# Altium project UAVCAN LIDAR.PrjPcb
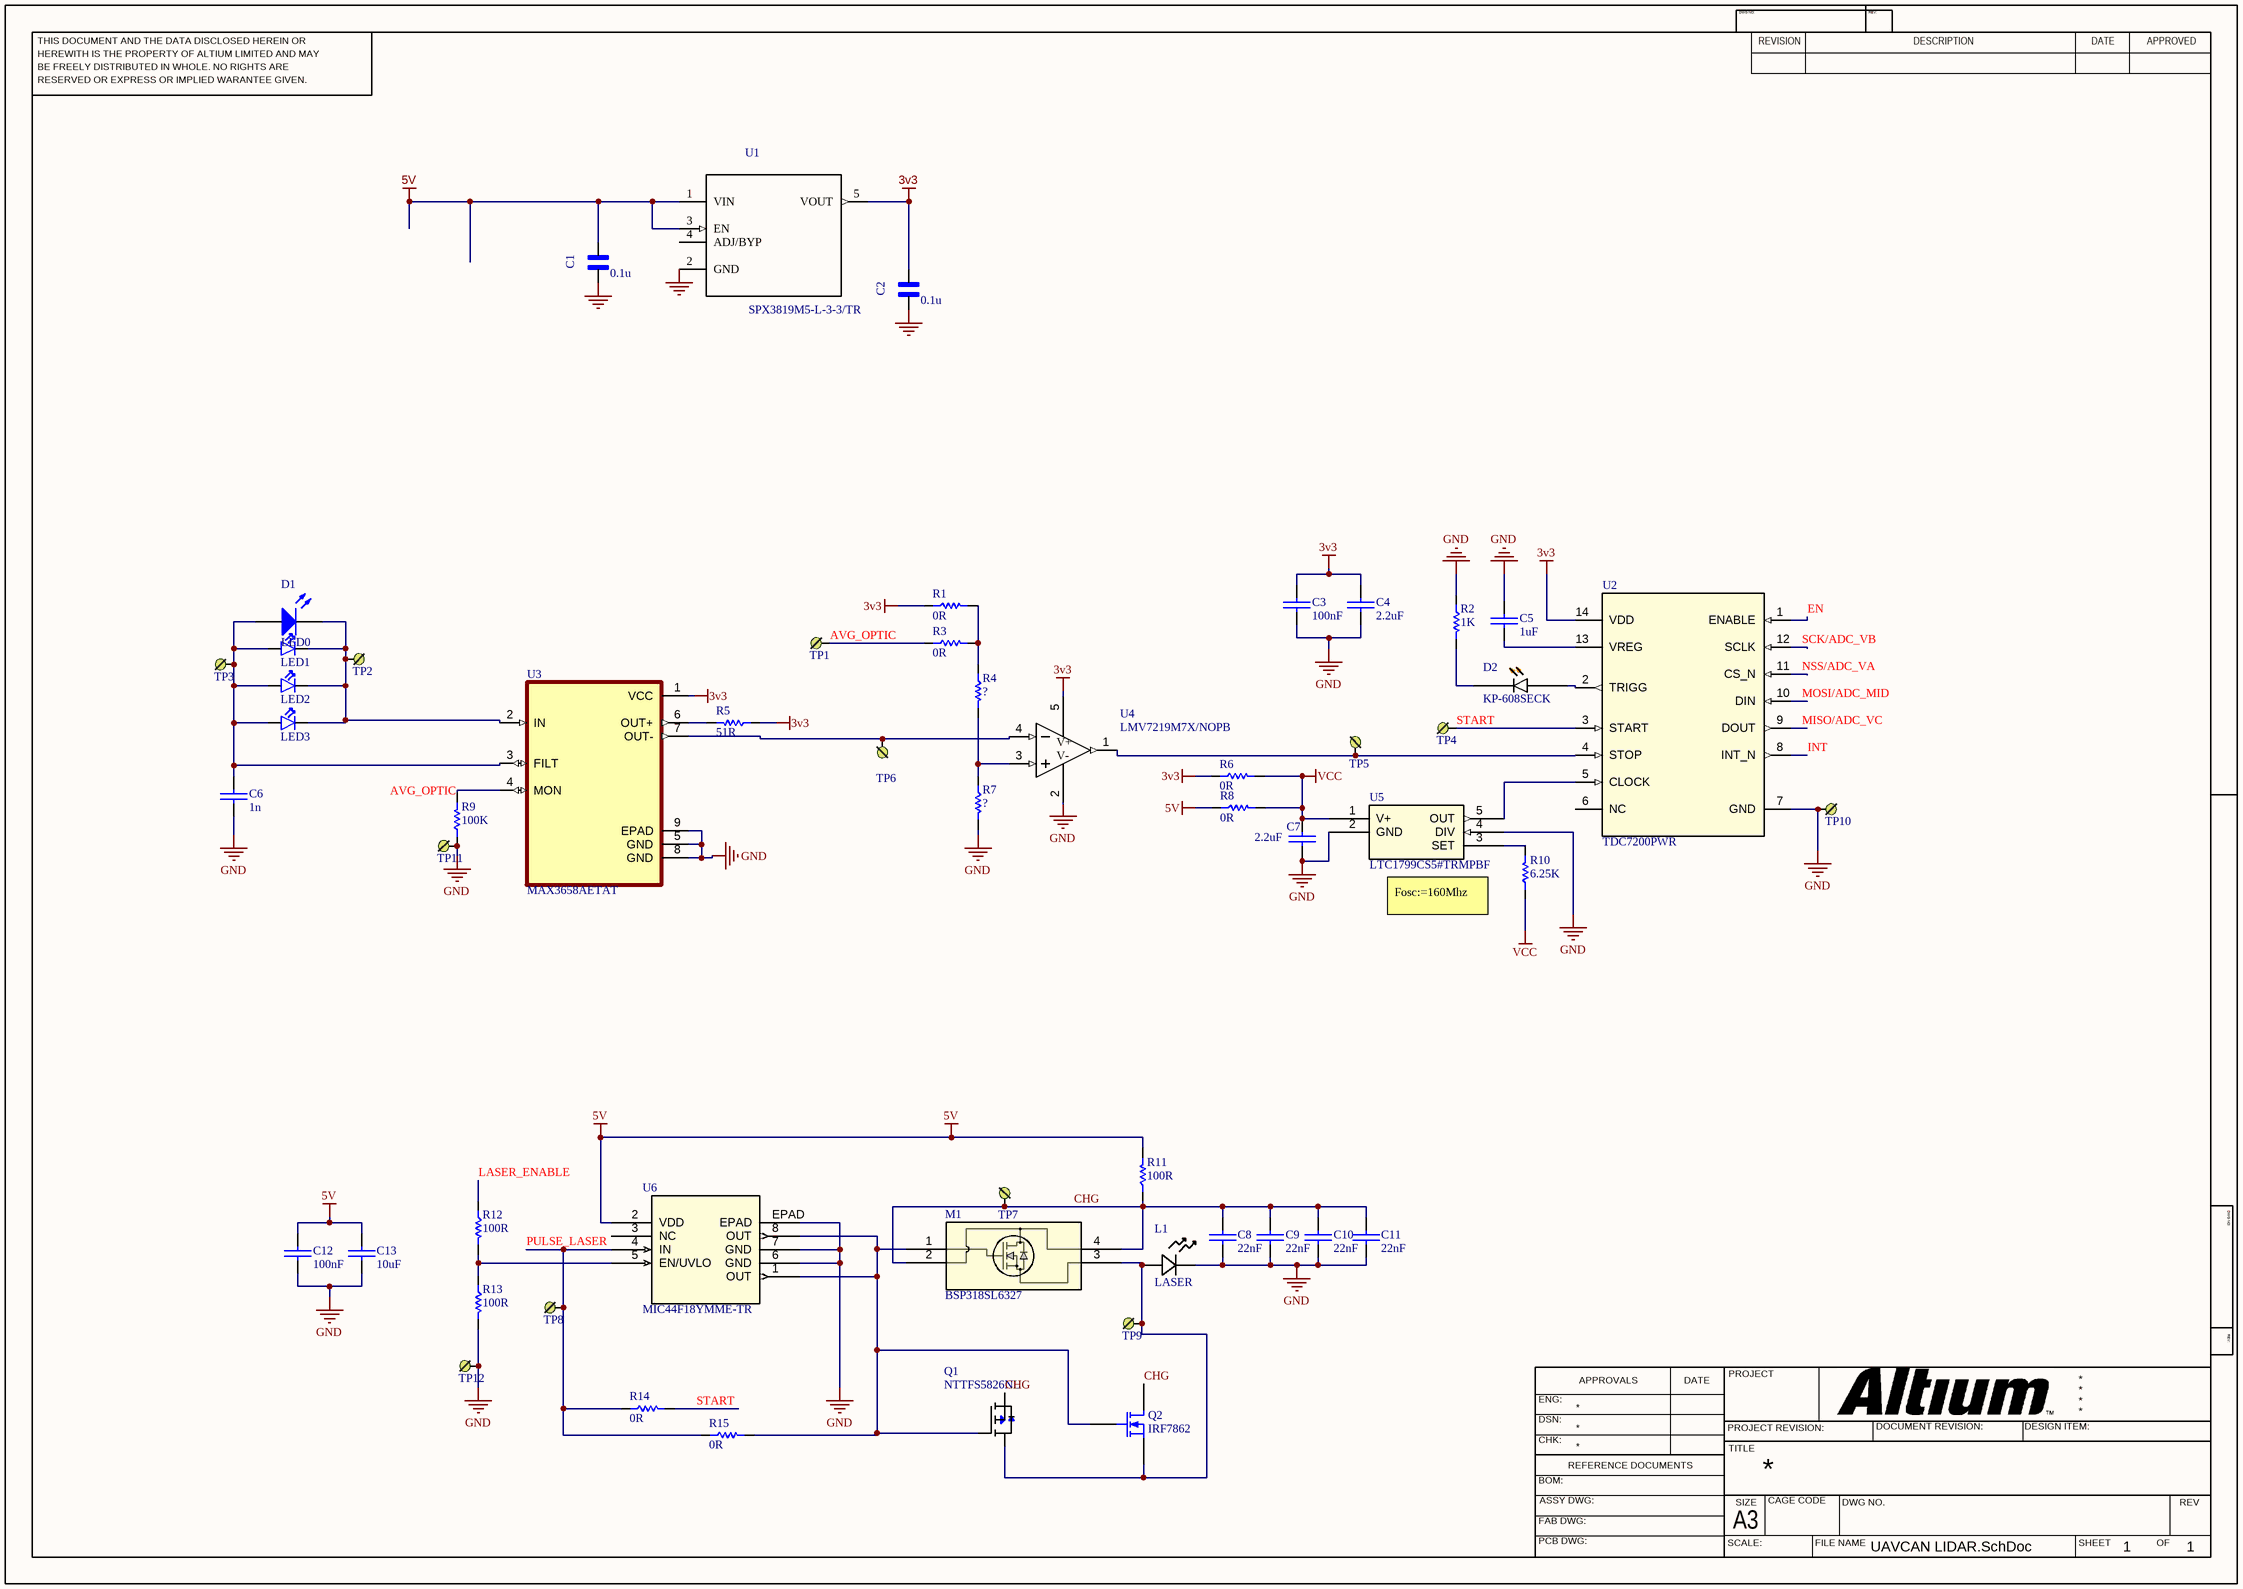
[diagram p0: UAVCAN LIDAR.SchDoc]
4 sheets, 103 parts. Net scope: global (net labels, ports and power ports of the same name join across sheets).
Board file: UAVCAN LIDAR.PcbDoc
Sheets:
  UAVCAN LIDAR.SchDoc
  STM32F103T8.SchDoc
  DCDC-LMR16030.SchDoc
  CONNECTORS.SchDoc

## Sheet UAVCAN LIDAR.SchDoc
size 420 x 297 mm; SheetNumber: 1; SheetTotal: 1

### Parts
C1  value 0.1u  [*CAPC1608X90]  (hidden comment: GX035C104MAT2-500)
C2  value 0.1u  [*CAPC1608X90]  (hidden comment: GX035C104MAT2-500)
C3  value 100nF  [SMD_CAP_0603]
C4  value 2.2uF  [SMD_CAP_0603]
C5  value 1uF  [SMD_CAP_0603]
C6  value 1n  [SMD_CAP_0603]
C7  value 2.2uF  [SMD_CAP_0603]
C8  value 22nF  [SMD_CAP_0603]
C9  value 22nF  [SMD_CAP_0603]
C10  value 22nF  [SMD_CAP_0603]
C11  value 22nF  [SMD_CAP_0603]
C12  value 100nF  [SMD_CAP_0603]
C13  value 10uF  [SMD_CAP_0603]
D1  LED0  [LED-0]
D2  KP-608SECK  [*LEDM1608X80_LTE-C1906R-14(Primary)]
L1  LASER  [SPL-PL90]
LED1  LED  [LED1206]  (value not drawn)
LED2  LED  [LED0805]  (value not drawn)
LED3  LED  [LED0603]  (value not drawn)
M1  BSP318SL6327  [PG-SOT223-4_INF-L]
Q1  NTTFS5826NL  [*TRANS_NVTFS015N04CTAG]
Q2  IRF7862  [*SO-08]
R1  0R  [RES 0603 (1608X06L)]
R2  1K  [RES 0603 (1608X06L)]
R3  0R  [RES 0603 (1608X06L)]
R4  ?  [RES 0603 (1608X06L)]
R5  51R  [RES 0603 (1608X06L)]
R6  0R  [RES 0603 (1608X06L)]
R7  ?  [RES 0603 (1608X06L)]
R8  0R  [RES 0603 (1608X06L)]
R9  100K  [RES 0603 (1608X06L)]
R10  6.25K  [RES 0603 (1608X06L)]
R11  100R  [RES 1210 (3226X07L)]
R12  100R  [RES 0603 (1608X06L)]
R13  100R  [RES 0603 (1608X06L)]
R14  0R  [RES 0603 (1608X06L)]
R15  0R  [RES 0603 (1608X06L)]
TP1  Test Point  [PAD1]  (value not drawn)
TP2  Test Point  [PAD1]  (value not drawn)
TP3  Test Point  [PAD1]  (value not drawn)
TP4  Test Point  [PAD1]  (value not drawn)
TP5  Test Point  [PAD1]  (value not drawn)
TP6  Test Point  [PAD1]  (value not drawn)
TP7  Test Point  [PAD1]  (value not drawn)
TP8  Test Point  [PAD1]  (value not drawn)
TP9  Test Point  [PAD1]  (value not drawn)
TP10  Test Point  [PAD1]  (value not drawn)
TP11  Test Point  [PAD1]  (value not drawn)
TP12  Test Point  [PAD1]  (value not drawn)
U1  SPX3819M5-L-3-3/TR  [*SOT95P280X145-5N]
U2  TDC7200PWR  [PW0014A_L]
U3  MAX3658AETAT  [SON65P300X300X80-9N]
U4  LMV7219M7X/NOPB  [SOT-5_S_LIT]
U5  LTC1799CS5#TRMPBF  [SOT-5_S_LIT]
U6  MIC44F18YMME-TR  [SOP65P490X104-9N]

### Nets
3v3: C2.1 C3.1(+) C4.1(+) R1.1 R5.1 R6.1 U1.5(VOUT) U2.14(VDD) U3.1(VCC) U4.5(V+)
5V: C1.1 C12.1(+) C13.1(+) R8.1 R11.2 U1.1(VIN) U1.3(EN) U6.2(VDD)
GND: C1.2 C2.2 C3.2(-) C4.2(-) C5.1(+) C6.2(-) C7.2(-) C8.2(-) C9.2(-) C10.2(-) C11.2(-) C12.2(-) C13.2(-) L1.1 R2.1 R7.2 R9.1 R13.2 TP10.1 TP11.1 TP12.1 U1.2(GND) U2.7(GND) U3.5(GND) U3.8(GND) U3.9(EPAD) U4.2(V-) U5.2(GND) U5.4(DIV) U6.6(GND) U6.7(GND) U6.EPAD
VCC: C7.1(+) R6.2 R8.2 R10.1 U5.1(V+)
AVG_OPTIC: R3.1 R9.2 TP1.1 U3.4(MON)
CHG: C8.1(+) C9.1(+) C10.1(+) C11.1(+) M1.2 M1.4 Q1.S Q2.D R11.1 TP7.1
EN: U2.1(ENABLE)
INT: U2.8(INT_N)
LASER_ENABLE: R12.1
MISO/ADC_VC: U2.9(DOUT)
MOSI/ADC_MID: U2.10(DIN)
NSS/ADC_VA: U2.11(CS_N)
PULSE_LASER: R14.1 R15.1 TP8.1 U6.4(IN)
SCK/ADC_VB: U2.12(SCLK)
START: R14.2 TP4.1 U2.3(START)
NetC5_2: C5.2(-) U2.13(VREG)
NetC6_1: C6.1(+) D1.1(A) LED1.1(A) LED2.1(A) LED3.1(A) TP3.1 U3.3(FILT)
NetD1_2: D1.2(K) LED1.2(K) LED2.2(K) LED3.2(K) TP2.1 U3.2(IN)
NetD2_A: D2.A U2.2(TRIGG)
NetD2_C: D2.C R2.2
NetL1_2: L1.2 M1.3 Q1.D Q2.S TP9.1
NetM1_1: M1.1 Q1.G Q2.G R15.2 U6.1(OUT) U6.8(OUT)
NetR1_2: R1.2 R3.2 R4.1
NetR4_2: R4.2 R7.1 U4.3(IN+)
NetR5_2: R5.2 U3.6(OUT+)
NetR10_2: R10.2 U5.3(SET)
NetR12_2: R12.2 R13.1 U6.5(EN/UVLO)
NetTP5_1: TP5.1 U2.4(STOP) U4.1(OUT)
NetTP6_1: TP6.1 U3.7(OUT-) U4.4(IN-)
NetU2_5: U2.5(CLOCK) U5.5(OUT)

Not connected (* = marked no-connect by the designer): U1 4(ADJ/BYP); U2 6(NC); U6 3(NC)

### Notes on the sheet
- Fosc:=160Mhz
- THIS DOCUMENT AND THE DATA DISCLOSED HEREIN OR
- HEREWITH IS THE PROPERTY OF ALTIUM LIMITED AND MAY
- DWG NO:
- REVISION
- REV:
- DESCRIPTION
- DATE
- APPROVED
- BE FREELY DISTRIBUTED IN WHOLE. NO RIGHTS ARE
- RESERVED OR EXPRESS OR IMPLIED WARANTEE GIVEN.
- ENG:
- APPROVALS
- PROJECT
- DSN:
- CHK:
- REFERENCE DOCUMENTS
- PROJECT REVISION:
- TITLE
- DOCUMENT REVISION:
- DESIGN ITEM:
- BOM:
- FAB DWG:
- PCB DWG:
- ASSY DWG:
- SCALE:
- A3
- SIZE
- CAGE CODE
- FILE NAME
- DWG NO.
- SHEET
- OF
- REV

### Library data of the parts
C1 C2 = GX035C104MAT2-500: Cap Thin Film 0.1uf 50v 0603; MF: AVX; Pacage Metric: 1608; Type: SMD; Package: 0603 AVX; MP: GX035C104MAT2-500; SnapEDA_Link: https://www.snapeda.com/parts/GX035C104MAT2-500/AVX/view-part/?ref=snap
C3-C13 = Cap-Bipolar: Bipolar Capacitor; Voltage: 100V; Designer: Saeid Jorablo; Organazation: ControTec; Adding Date: 1387/12/20
D1 = LED0: Typical INFRARED GaAs LED; Published: 8-Jun-2000; LatestRevisionDate: 08-Jul-2005; LatestRevisionNote: Mech Layer 1 removed.; PackageReference: LED-0; Publisher: Altium Limited; PackageDescription: LED; 2 Leads
D2 = 0603-LED-ORANGE: Orange 605nm LED Indication - Discrete 2.2V 0603 (1608 Metric); MP: SML-D12D1WT86 or LTST-C194KFKT; Type: SMD; Package: 0603 Lite-On; SnapEDA_Link: https://www.snapeda.com/parts/SML-D12D1WT86/Rohm/view-part/?ref=search&t=0603%20LED%20orange; Value: *
L1 = SPL-PL90: 5mm Laser beam transmitter; Designer: EhsanShaghaei; ChipDip_Link: https://www.chipdip.ru/product0/8001775090
LED1-LED3 = LED: Designer :: Razi Research Team Of Mashhad - Hamed Jafarzadeh
M1 = BSP318SL6327: No Description Available; Vendor: Infineon; Built_By: EMA_Cory; SourceLibrary: Add_to_database_2021-03-11; Designer: EhsanShaghaei; Datasheet: https://www.mouser.com/datasheet/2/196/Infineon-BSP318S-DS-v02_04-en-522823.pdf; Manufacturer_Part_Number: BSP318SL6327; Copyright: Copyright (C) 2018 Accelerated Designs. All rights reserved; RefDes: RefDes; Type: DEV; ChipDip_Link: https://www.chipdip.ru/product0/8001781161
Q1 = NTTFS5826NL: NTTFS5826NLTAG, MOSFET N-CHANNEL 60V 20A 24MOHM WDFN8; SnapEDA_Link: https://www.snapeda.com/parts/NVTFS5124PLTAG/ON%20Semiconductor/view-part/?ref=search&t=NVTFS5124PLTAG; Value: *; ChipDip_Link: https://www.chipdip.ru/product/nttfs5826nltag-mosfet-n-channel-60v-20a; HelpURL: http://www.farnell.com/datasheets/2028673.pdf
Q2 = IRF7862: N-Channel MOSFET; Published: 8-Jun-2000; LatestRevisionDate: 17-Jul-2002; LatestRevisionNote: Re-released for DXP Platform.; PackageVersion: 1995/1996; PackageReference: E3; Publisher: Altium Limited; PackageDescription: TO, Flat Index; 3 In-Line, Axial Leads; Body Dia. 4.6mm; Lead Dia. 0.5 mm (max)
R1-R15 = Resistor: Tolerance: 5%; Power: 1/8 W
  R1 R3 R6 R8 R14 R15: Value: 0R
  R2: Value: 1K
  R4 R7: Value: ?
  R5: Value: 51R
  R9: Value: 100K
  R10: Value: 6.25K
  R11-R13: Value: 100R
TP1-TP12 = PLUG
U1 = SPX3819M5-L: Low Dropout Voltage Regulator, Adjustable 0.5A, В±1%, 2.5 to 16 Vin, 5-Pin SOT-23 /; MF: MaxLinear, Inc.; Value: 3V3; MP: SPX3819M5-L-3-3/TR; Package: SOT-23-5 Exar; SnapEDA_Link: https://www.snapeda.com/parts/SPX3819M5-L/MaxLinear%2C%20Inc./view-part/?ref=snap; Type: SMD; ChipDip_Link: https://www.chipdip.ru/product1/8003455237; HelpURL: http://www.farnell.com/datasheets/2614478.pdf
U2 = TDC7200PWR: Designer: Ehsan Shaghaei; ChipDip_Link: https://www.chipdip.ru/product1/8002200734
U3 = MAX3658AETAT: MF: {'manufacturer': u'Maxim Integrated'}; Availability: Unavailable; MP: MAX3658AETAT; Price: None; Value: *; Package: None
U4 = LMV7219M7X/NOPB: Manufacturer: NationalSemiconductor; Characteristics: LMV7219M77nsec27Vto5VcomparatorwithRail-to-RailOutput; CompType: ComparatorIC; TaMin_C: -400; TaMax_C: 850; ComponentLink1DescBC: LMV7219Datasheet; ComponentLink2DescA4: LMV7219WebPage; ComponentLink3DescAC: MAA05APackageWebPage; Designer: EhsanShaghaei; Copyright: Copyright (C) 2018 Accelerated Designs. All rights reserved; SymbolVersion: 2008-07-09; PartNumber: LMV7219M7; PackageDescription: 5LeadSC-70; PackageReference: MAA05A_L; RoHS: O; ComponentLink1URL: http//wwwnationalcom/ds/LM/LMV7219pdf; ComponentLink2URL: http//wwwnationalcom/pf/LM/LMV7219html; ComponentLink3URL: http//wwwnationalcom/packaging/folders/maa05ahtml; Version: B1608; LatestRevisionDate: 2009-03-16; LatestRevisionNote: MassUpdate; Publisher: NationalSemiconductor; Published: 2009-03-16; ChipDip_Link: https://www.chipdip.ru/product0/8005529462; ComponentLink1Description: New link; ComponentLink1URL: *
U5 = LTC1799CS5: Vendor: Linear Technology; Built_By: EMA_UL_Team; SourceLibrary: LinearTech_2016_03_08; Manufacturer_Part_Number: LTC1799CS5#TRMPBF; Copyright: Copyright (C) 2018 Accelerated Designs. All rights reserved; RefDes: RefDes; Type: DEV; ComponentLink1Description: ChipDip_Link; ComponentLink1URL: https://www.chipdip.ru/product1/8002977151; ComponentLink2Description: Designer; ComponentLink2URL: Ehsan Shaghaei
U6 = MIC44F18YMME-TR: No Description Available; Vendor: Microchip; Built_By: EMA_Molly; SourceLibrary: Microchip_2019-09-03; Designer: Ehsan Shaghaei; Manufacturer_Part_Number: MIC44F18YMME-TR; Copyright: Copyright (C) 2018 Accelerated Designs. All rights reserved; RefDes: RefDes; Type: DEV; ChipDip_Link: https://www.chipdip.ru/product/mic44f18ymme

## Sheet STM32F103T8.SchDoc
size A3; Revision: 10
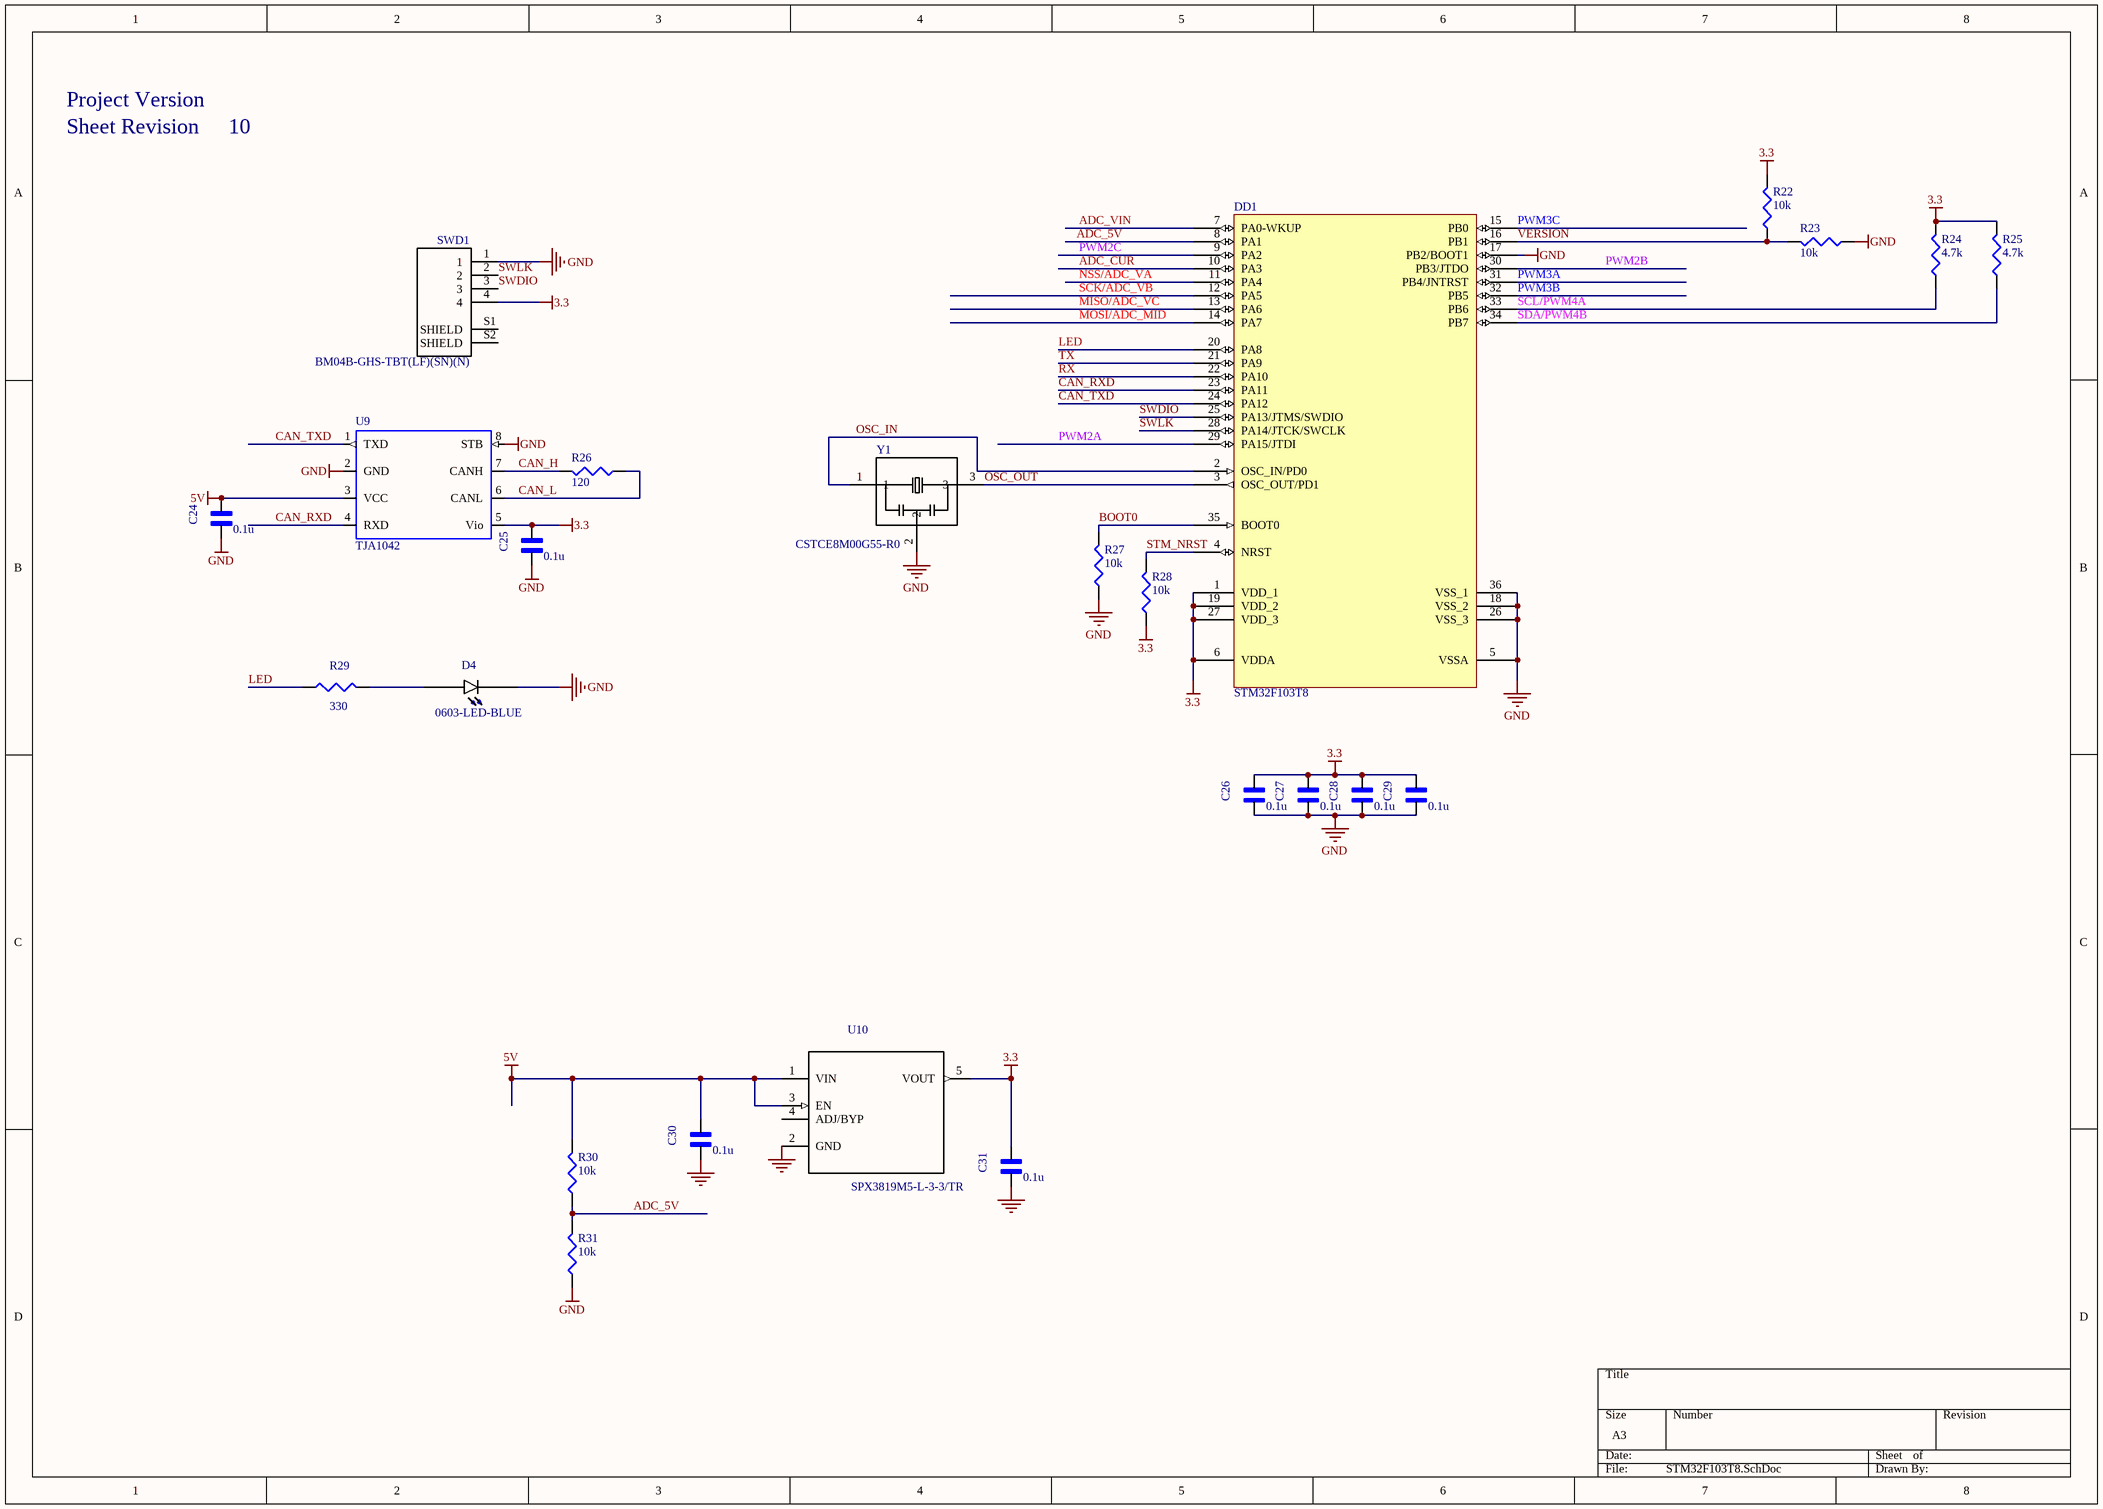
[diagram p1: STM32F103T8.SchDoc]

### Parts
C24  value 0.1u  [*CAPC1608X90]  (hidden comment: GX035C104MAT2-500)
C25  value 0.1u  [*CAPC1608X90]  (hidden comment: GX035C104MAT2-500)
C26  value 0.1u  [*CAPC1608X90]  (hidden comment: GX035C104MAT2-500)
C27  value 0.1u  [*CAPC1608X90]  (hidden comment: GX035C104MAT2-500)
C28  value 0.1u  [*CAPC1608X90]  (hidden comment: GX035C104MAT2-500)
C29  value 0.1u  [*CAPC1608X90]  (hidden comment: GX035C104MAT2-500)
C30  value 0.1u  [*CAPC1608X90]  (hidden comment: GX035C104MAT2-500)
C31  value 0.1u  [*CAPC1608X90]  (hidden comment: GX035C104MAT2-500)
D4  0603-LED-BLUE  [*LEDM1608X80_LTE-C1906R-14(Primary)]
DD1  STM32F103T8  [*QFN50P600X600X100-37N]
R22  value 10k  [J1-0603]  (hidden comment: RC0603FR-0710KL)
R23  value 10k  [J1-0603]  (hidden comment: RC0603FR-0710KL)
R24  value 4.7k  [J1-0603]  (hidden comment: Res3)
R25  value 4.7k  [J1-0603]  (hidden comment: Res3)
R26  value 120  [J1-0603]  (hidden comment: Res3)
R27  value 10k  [J1-0603]  (hidden comment: RC0603FR-0710KL)
R28  value 10k  [J1-0603]  (hidden comment: RC0603FR-0710KL)
R29  value 330  [J1-0603]  (hidden comment: Res3)
R30  value 10k  [J1-0603]  (hidden comment: RC0603FR-0710KL)
R31  value 10k  [J1-0603]  (hidden comment: RC0603FR-0710KL)
SWD1  BM04B-GHS-TBT(LF)(SN)(N)  [JST_BM04B-GHS-holes]
U9  TJA1042  [SOT782-1]
U10  SPX3819M5-L-3-3/TR  [*SOT95P280X145-5N]
Y1  CSTCE8M00G55-R0  [*OSC_CSTCE8M00G55-R0]

### Nets
3.3: C25.1 C26.1 C27.1 C28.1 C29.1 C31.1 DD1.1(VDD_1) DD1.6(VDDA) DD1.19(VDD_2) DD1.27(VDD_3) R22.2 R24.2 R25.2 R28.1 SWD1.4 U9.5(Vio) U10.5(VOUT)
5V: C24.1 C30.1 R30.2 U9.3(VCC) U10.1(VIN) U10.3(EN)
GND: C24.2 C25.2 C26.2 C27.2 C28.2 C29.2 C30.2 C31.2 D4.C DD1.5(VSSA) DD1.17(PB2/BOOT1) DD1.18(VSS_2) DD1.26(VSS_3) DD1.36(VSS_1) R23.1 R27.1 R31.1 SWD1.1 U9.2(GND) U9.8(STB) U10.2(GND) Y1.2
ADC_5V: DD1.8(PA1) R30.1 R31.2
ADC_CUR: DD1.10(PA3)
ADC_VIN: DD1.7(PA0-WKUP)
BOOT0: DD1.35(BOOT0) R27.2
CAN_H: R26.2 U9.7(CANH)
CAN_L: R26.1 U9.6(CANL)
CAN_RXD: DD1.23(PA11) U9.4(RXD)
CAN_TXD: DD1.24(PA12) U9.1(TXD)
LED: DD1.20(PA8) R29.1
MISO/ADC_VC: DD1.13(PA6)
MOSI/ADC_MID: DD1.14(PA7)
NSS/ADC_VA: DD1.11(PA4)
OSC_IN: DD1.2(OSC_IN/PD0) Y1.1
OSC_OUT: DD1.3(OSC_OUT/PD1) Y1.3
PWM2A: DD1.29(PA15/JTDI)
PWM2B: DD1.30(PB3/JTDO)
PWM2C: DD1.9(PA2)
PWM3A: DD1.31(PB4/JNTRST)
PWM3B: DD1.32(PB5)
PWM3C: DD1.15(PB0)
RX: DD1.22(PA10)
SCK/ADC_VB: DD1.12(PA5)
SCL/PWM4A: DD1.33(PB6) R24.1
SDA/PWM4B: DD1.34(PB7) R25.1
STM_NRST: DD1.4(NRST) R28.2
SWDIO: DD1.25(PA13/JTMS/SWDIO) SWD1.3
SWLK: DD1.28(PA14/JTCK/SWCLK) SWD1.2
TX: DD1.21(PA9)
VERSION: DD1.16(PB1) R22.1 R23.2
NetD4_A: D4.A R29.2

Not connected (* = marked no-connect by the designer): SWD1 S1(SHIELD) S2(SHIELD); U10 4(ADJ/BYP)

### Notes on the sheet
- Project Version
- Sheet Revision

### Library data of the parts
C24-C29 = GX035C104MAT2-500: Cap Thin Film 0.1uf 50v 0603; MF: AVX; MP: GX035C104MAT2-500 or CL10B104JB8NNNC; Pacage Metric: 1608; Type: SMD; Package: 0603 AVX; SnapEDA_Link: https://www.snapeda.com/parts/GX035C104MAT2-500/AVX/view-part/?ref=snap
C30 C31 = GX035C104MAT2-500: as C1 on sheet UAVCAN LIDAR; Package: 0603 AVX; MP: GX035C104MAT2-500; SnapEDA_Link: https://www.snapeda.com/parts/GX035C104MAT2-500/AVX/view-part/?ref=snap
D4 = LTE-C1906R-14: LED IrLED Chip LED 2-Pin SMD T/R; Package: 0603 Lite-On; MP: 0603-LED-BLUE; SnapEDA_Link: https://www.snapeda.com/parts/LTE-C1906R-14/Lite-On%20Inc./view-part/?ref=snap; Value: *; Type: SMD
DD1 = STM32F103T8: STM32F103T8U6, Микроконтроллер 32BIT ARM 64K FLASH [VFQFPN-36]; MF: STM; ChipDip_Link: https://www.chipdip.ru/product/stm32f103t8u6-2; HelpURL: http://www.st.com/stonline/products/literature/ds/13587.pdf; MP: STM32F103T8U6; Package: VFQFPN-36; SnapEDA_Link: https://www.snapeda.com/parts/STM32F103T8U6TR/STMicroelectronics/view-part/?ref=search&t=STM32F103T8U6; Type: SMD
R22 R23 R27 R28 R30 R31 = RC0603FR-0710KL: 10 kOhms 1 0.1 W 1 10 W Chip Resistor 0603 1608 Metric Thick Film; Pacage Metric: 1608; MF: Yageo or NXP; MP: 10K 1% 0603; ChipDip_Link: https://www.chipdip.ru/product0/9000079736; HelpURL: https://www.chipdip.ru/product0/9000079736; Package: R0603; Type: SMD; SnapEDA_Link: https://www.snapeda.com/parts/RC0603FR-0710KL/Yageo/view-part/?ref=dk&t=RC0603FR-0710KL&con_ref=None
R24 R25 = Res3: Resistor; Pacage Metric: 1608; MP: 4.7K 1% 0603; ChipDip_Link: https://www.chipdip.ru/product0/9000079736; HelpURL: https://www.chipdip.ru/product0/9000079736; Package: R0603; Type: SMD
R26 = Res3: 120 Ohms 1 0.1 W 1 10 W Chip Resistor 0603 1608 Metric Thick Film; Pacage Metric: 1608; MP: RC0603FR-07120RL; ChipDip_Link: https://www.chipdip.ru/product0/9000079618; HelpURL: https://www.chipdip.ru/product0/9000079618; Package: R0603; Type: SMD
R29 = Res3: Resistor; Pacage Metric: 1608; MP: RC0603FR-07330RL; ChipDip_Link: https://www.chipdip.ru/product0/9000079628; HelpURL: https://www.chipdip.ru/product0/9000079628; Package: R0603; Type: SMD
SWD1 = BM04B-GHS-TBT(LF)(SN)(N): Conn Shrouded Header HDR 4 POS 1.25mm Solder ST SMD Reel; MF: JST Sales; MP: SM04B-GHS-TB(LF)(SN); Instructions: Do not install; System: Connector; SnapEDA_Link: https://www.snapeda.com/parts/BM04B-GHS-TBT%28LF%29%28SN%29%28N%29/JST%20Sales%20America%20Inc./view-part/?ref=snap; Package: None; Value: *; Type: SMD
U9 = TJA1042: 1/1 Transceiver Half CANbus 8-SO; MF: NXP USA; SnapEDA_Link: https://www.snapeda.com/parts/TJA1042/NXP%20USA%20Inc./view-part/900919/?ref=snap; Value: *; MP: TJA1042; Package: VDFN-8 NXP USA; ChipDip_Link: https://www.chipdip.ru/product1/8002840332; HelpURL: https://static.chipdip.ru/lib/583/DOC001583059.pdf; Type: SMD
U10 = SPX3819M5-L: as U1 on sheet UAVCAN LIDAR; MP: SPX3819M5-L-3-3/TR; Package: SOT-23-5 Exar; SnapEDA_Link: https://www.snapeda.com/parts/SPX3819M5-L/MaxLinear%2C%20Inc./view-part/?ref=snap; Type: SMD; ChipDip_Link: https://www.chipdip.ru/product1/8003455237; HelpURL: http://www.farnell.com/datasheets/2614478.pdf
Y1 = CSTCE8M00G55-R0: Ceramic Resonator 8MHz ??0.5% _Tol_ ??0.2% _Stability_ 33pF 40Ohm 3-Pin CSMD T/R; MF: Murata; MP: CSTCE8M00G55-R0; Package: SMD-3 Murata; SnapEDA_Link: https://www.snapeda.com/parts/CSTCE8M00G55-R0/Murata%20Electronics%20North%20America/view-part/?ref=snap; Value: *; ChipDip_Link: https://www.chipdip.ru/product1/8001783721; HelpURL: https://www.murata.com/en-eu/api/pdfdownloadapi?cate=&partno=CSTCE8M00G55-R0; Type: SMD

## Sheet DCDC-LMR16030.SchDoc
size A3; Revision: 8
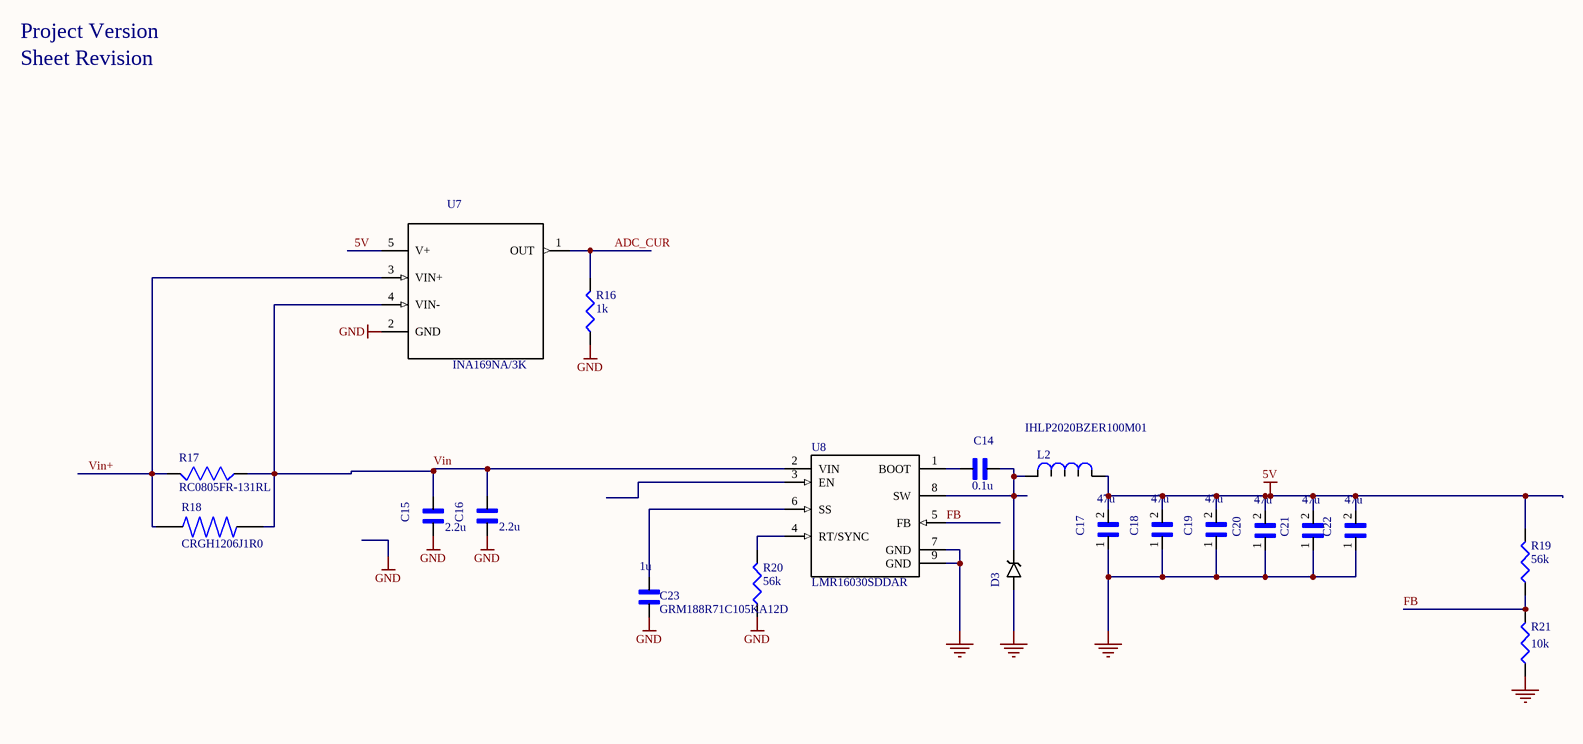
[diagram p2: DCDC-LMR16030.SchDoc]

### Parts
C14  value 0.1u  [*CAPC1608X90]  (hidden comment: GX035C104MAT2-500)
C15  value 2.2u  [*CAP3216X125N]  (hidden comment: GRM31CR71H225KA88L)
C16  value 2.2u  [*CAP3216X125N]  (hidden comment: GRM31CR71H225KA88L)
C17  value 47u  [*CAPC3216X125N]  (hidden comment: GRM31CR61A476KE15L)
C18  value 47u  [*CAPC3216X125N]  (hidden comment: GRM31CR61A476KE15L)
C19  value 47u  [*CAPC3216X125N]  (hidden comment: GRM31CR61A476KE15L)
C20  value 47u  [*CAPC3216X125N]  (hidden comment: GRM31CR61A476KE15L)
C21  value 47u  [*CAPC3216X125N]  (hidden comment: GRM31CR61A476KE15L)
C22  value 47u  [*CAPC3216X125N]  (hidden comment: GRM31CR61A476KE15L)
C23  GRM188R71C105KA12D  value 1u  [CAPC1608X90N]
D3  SK56  [*SMB_P6SMB62AT3G(Primary)]  (value not drawn)
L2  IHLP2020BZER100M01  [IHLP]
R16  value 1k  [J1-0603]  (hidden comment: Res3)
R17  RC0805FR-131RL  [RESC2012X60]
R18  CRGH1206J1R0  [RESC3115X65N]
R19  value 56k  [J1-0603]  (hidden comment: Res3)
R20  value 56k  [J1-0603]  (hidden comment: Res3)
R21  value 10k  [J1-0603]  (hidden comment: RC0603FR-0710KL)
U7  INA169NA/3K  [*SOT95P280X145-5N]
U8  LMR16030SDDAR  [*SOIC127P600X170-9N - duplicate]

### Nets
5V: C17.2 C18.2 C19.2 C20.2 C21.2 C22.2 L2.1 R19.2 U7.5(V+)
GND: C15.2 C16.2 C17.1 C18.1 C19.1 C20.1 C21.1 C22.1 C23.1 D3.A R16.1 R20.1 R21.1 U7.2(GND) U8.7(GND) U8.9(GND)
Vin+: R17.1 R18.1 U7.3(VIN+)
ADC_CUR: R16.2 U7.1(OUT)
FB: R19.1 R21.2 U8.5(FB)
Vin: C15.1 C16.1 R17.2 R18.2 U7.4(VIN-) U8.2(VIN)
NetC14_1: C14.1 D3.C L2.2 U8.8(SW)
NetC14_2: C14.2 U8.1(BOOT)
NetC23_2: C23.2 U8.6(SS)
NetR20_2: R20.2 U8.4(RT/SYNC)

Not connected (* = marked no-connect by the designer): U8 3(EN)

### Notes on the sheet
- Project Version
- Sheet Revision

### Library data of the parts
C14 = GX035C104MAT2-500: as C24 on sheet STM32F103T8; Package: 0603 AVX; SnapEDA_Link: https://www.snapeda.com/parts/GX035C104MAT2-500/AVX/view-part/?ref=snap
C15 C16 = GRM31CR71H225KA88L: / 1206 2.2 uF 50 V В±10% Tolerance X7R SMT Multilayer Ceramic Capacitor /; MF: Murata Electronics; Type: SMD; Package: 1206 Murata; SnapEDA_Link: https://www.snapeda.com/parts/GRM31CR71H225KA88L/Murata%20Electronics%20North%20America/view-part/?ref=snap; MP: GRM31CR71H225KA88L
C17-C22 = GRM31CR61A476KE15L: Multilayer Ceramic Capacitor, GRM Series, 47 - F, - 10%, X5R, 10 V, 1206 [3216 Metric]; MF: Murata Electronics; Type: SMD; Package: 1206 Murata Electronics; MP: GRM31CR61A476KE15L; SnapEDA_Link: https://www.snapeda.com/parts/GRM31CR61A476KE15L/Murata%20Electronics%20North%20America/view-part/?ref=snap
C23 = GRM188R71C105KA12D: SMD Capacitor X7R(EIA) with Capacitance: 1.0uF Tol. 10%. Rated Voltage: 16Vdc; MF: Murata Electronics; Pacage Metric: 1608; MP: GRM188R71C105KA12D; SnapEDA_Link: https://www.snapeda.com/parts/GRM188R71C105KA12D/Murata%20Electronics%20North%20America/view-part/228340/?ref=snap; Package: 0603; ChipDip_Link: https://www.chipdip.ru/product/grm188r71c105ka12d; HelpURL: https://static.chipdip.ru/lib/428/DOC005428493.pdf; Type: SMD
D3 = SK56: Диод Шоттки 5А 60В [SMB / DO-214AA]; MF: Littelfuse Inc.; Type: SMD; MP: SK56; Package: DO-214 Littelfuse; SnapEDA_Link: https://www.snapeda.com/parts/P6SMB62AT3G/Littelfuse%20Inc./view-part/?ref=snap; Value: *; ChipDip_Link: https://www.chipdip.ru/product/sk56
L2 = IHLP2020BZER100M01: 10ÂµH Shielded Molded Inductor 2.3A 199mOhm Max Nonstandard; MF: Vishay Dale; Type: SMD; SnapEDA_Link: https://www.snapeda.com/parts/IHLP2020BZER100M01/Vishay%20Dale/view-part/44808/?ref=snap; MP: IHLP2020BZER100M01; Value: *; Package: Nonstandard Vishay; HelpURL: http://www.vishay.com/docs/34253/ihlp-2020bz-01.pdf; ChipDip_Link: https://www.chipdip.ru/product/ihlp2020bzer100m11-inductor-ihlp-smd-2020-10
R16 = Res3: Resistor; Published: 8-Jun-2000; LatestRevisionDate: 29-May-2009; LatestRevisionNote: IPC-7351 Footprint Added.; PackageReference: J1-0603; Publisher: Altium Limited; PackageDescription: Chip Resistor
R17 = RC0805FR-131RL: RC Series 0805 0.125 W 2 kOhms 5% В±100 ppm/В°C SMT Thick Film Chip Resistor; MF: {'manufacturer': u'Yageo'}; Availability: Unavailable; MP: RC0805FR-131RL; Value: *; Price: None; Package: None
R18 = CRGH1206J1R0: Res Thick Film 1206 1 Ohm 5% 1/2W В±200ppm/В°C Molded SMD SMD T/R; MF: {'manufacturer': u'TE Connectivity'}; Availability: Unavailable; Price: None; Package: None; Value: *; MP: CRGH1206J1R0
R19 R20 = Res3: Resistor; Pacage Metric: 1608; MP: RC0603FR-0756KL; ChipDip_Link: https://www.chipdip.ru/product0/9000079754; HelpURL: https://www.chipdip.ru/product0/9000079754; Package: R0603; Type: SMD
R21 = RC0603FR-0710KL: as R22 on sheet STM32F103T8; ChipDip_Link: https://www.chipdip.ru/product0/9000079736; HelpURL: https://www.chipdip.ru/product0/9000079736; Package: R0603; Type: SMD; SnapEDA_Link: https://www.snapeda.com/parts/RC0603FR-0710KL/Yageo/view-part/?ref=dk&t=RC0603FR-0710KL&con_ref=None
U7 = INA169NA/3K: Current Monitor Regulator High-Side SOT-23-5; MF: Texas Instruments; Package: SOT-23-5 Texas Instruments; Availability: Unavailable; SnapEDA_Link: https://www.snapeda.com/parts/INA169NA/3K/Texas%20Instruments/view-part/449193/?ref=snap; MP: INA169NA/3K; Price: None; Value: *
U8 = LMR16030SDDAR: LMR16030SDDAR, Conv DC-DC 4.3V to 60V Step Down Single-Out 1V to 50V 3A Automotive 8-Pin HSOP EP T/R; MF: Texas Instruments; SnapEDA_Link: https://www.snapeda.com/parts/TPS54560DDA/Texas%20Instruments/view-part/?ref=snap; MP: LMR16030SDDAR; Package: PowerSOIC-8 Texas Instruments; Value: *; Type: SMD; ChipDip_Link: https://www.chipdip.ru/product1/8003448566; HelpURL: https://www.ti.com/lit/ds/symlink/lmr16030.pdf

## Sheet CONNECTORS.SchDoc
size A3; Revision: 7
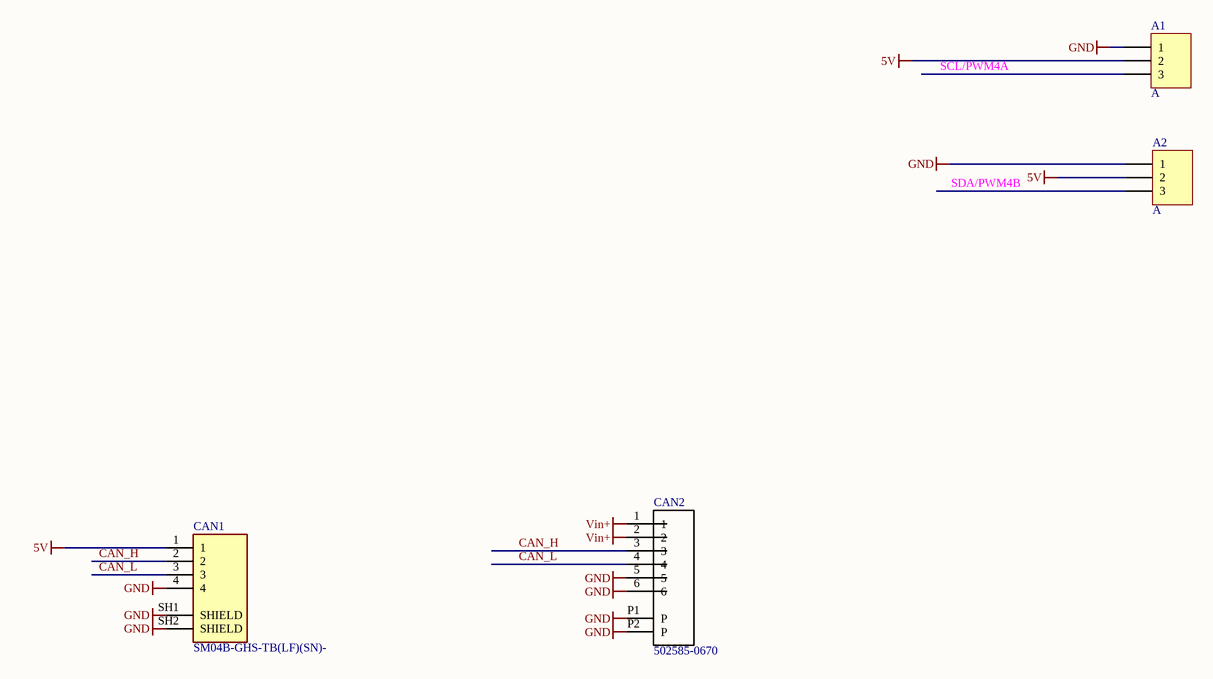
[diagram p3: CONNECTORS.SchDoc]

### Parts
A1  A  [HDR Side 3 pin]
A2  A  [HDR Side 3 pin]
CAN1  SM04B-GHS-TB(LF)(SN)-  [JST_SM04B-GHS-TB(LF)(SN)-]
CAN2  502585-0670  [MOLEX_502585-0670]

### Nets
5V: A1.2 A2.2 CAN1.1
GND: A1.1 A2.1 CAN1.4 CAN1.SH1(SHIELD) CAN1.SH2(SHIELD) CAN2.5 CAN2.6 CAN2.P1(P) CAN2.P2(P)
Vin+: CAN2.1 CAN2.2
CAN_H: CAN1.2 CAN2.3
CAN_L: CAN1.3 CAN2.4
SCL/PWM4A: A1.3
SDA/PWM4B: A2.3

### Library data of the parts
A1 A2 = Header 3: Header, 4-Pin; System: Connector; MF: Connfly electronic (Zhenqin); MP: PLS-3 (DS1021-1x3); Type: SMD; ChipDip_Link: https://www.chipdip.ru/product/pls-3; HelpURL: https://static.chipdip.ru/lib/227/DOC000227157.pdf
CAN1 = SM04B-GHS-TB(LF)(SN)-: Connector Header Surface Mount, Right Angle 4 position 0.049 _1.25mm_; MP: SM04B-GHS-TB_LF__SN_-; MF: JST Sales; Availability: Unavailable; Package: None; Value: *; Price: None; SnapEDA_Link: https://www.snapeda.com/parts/SM04B-GHS-TB%28LF%29%28SN%29-/JST%20Sales%20America%20Inc./view-part/2759740/?ref=snap; HelpURL: http://www.farnell.com/datasheets/2082975.pdf; System: Connector; ChipDip_Link: https://www.chipdip.ru/product/sm04b-ghs-tb-lf-sn-gh-1.25mm-header-side-ent
CAN2 = 502585-0670: 1.50mm Pitch, CLIK-Mate PCB Receptacle, Single Row, Surface Mount, Right-Angle, Tin Plating, Positive Lock, 6 Circuits, Natural; MP: 502494-0670; MF: Molex; System: Connector; Availability: Unavailable; Package: None; SnapEDA_Link: https://www.snapeda.com/parts/502494-0670/Molex/view-part/?ref=snap; Price: None; Value: *

## Nets that join several sheets
5V: UAVCAN LIDAR (8 pins), STM32F103T8 (6 pins), DCDC-LMR16030 (9 pins), CONNECTORS (A1.2 A2.2 CAN1.1)
GND: UAVCAN LIDAR (32 pins), STM32F103T8 (22 pins), DCDC-LMR16030 (16 pins), CONNECTORS (9 pins)
Vin+: DCDC-LMR16030 (R17.1 R18.1 U7.3), CONNECTORS (CAN2.1 CAN2.2)
ADC_CUR: STM32F103T8 (DD1.10), DCDC-LMR16030 (R16.2 U7.1)
CAN_H: STM32F103T8 (R26.2 U9.7), CONNECTORS (CAN1.2 CAN2.3)
CAN_L: STM32F103T8 (R26.1 U9.6), CONNECTORS (CAN1.3 CAN2.4)
MISO/ADC_VC: UAVCAN LIDAR (U2.9), STM32F103T8 (DD1.13)
MOSI/ADC_MID: UAVCAN LIDAR (U2.10), STM32F103T8 (DD1.14)
NSS/ADC_VA: UAVCAN LIDAR (U2.11), STM32F103T8 (DD1.11)
SCK/ADC_VB: UAVCAN LIDAR (U2.12), STM32F103T8 (DD1.12)
SCL/PWM4A: STM32F103T8 (DD1.33 R24.1), CONNECTORS (A1.3)
SDA/PWM4B: STM32F103T8 (DD1.34 R25.1), CONNECTORS (A2.3)